# Altium schematic sheet CYAN_AMP_2.SchDoc
size A3
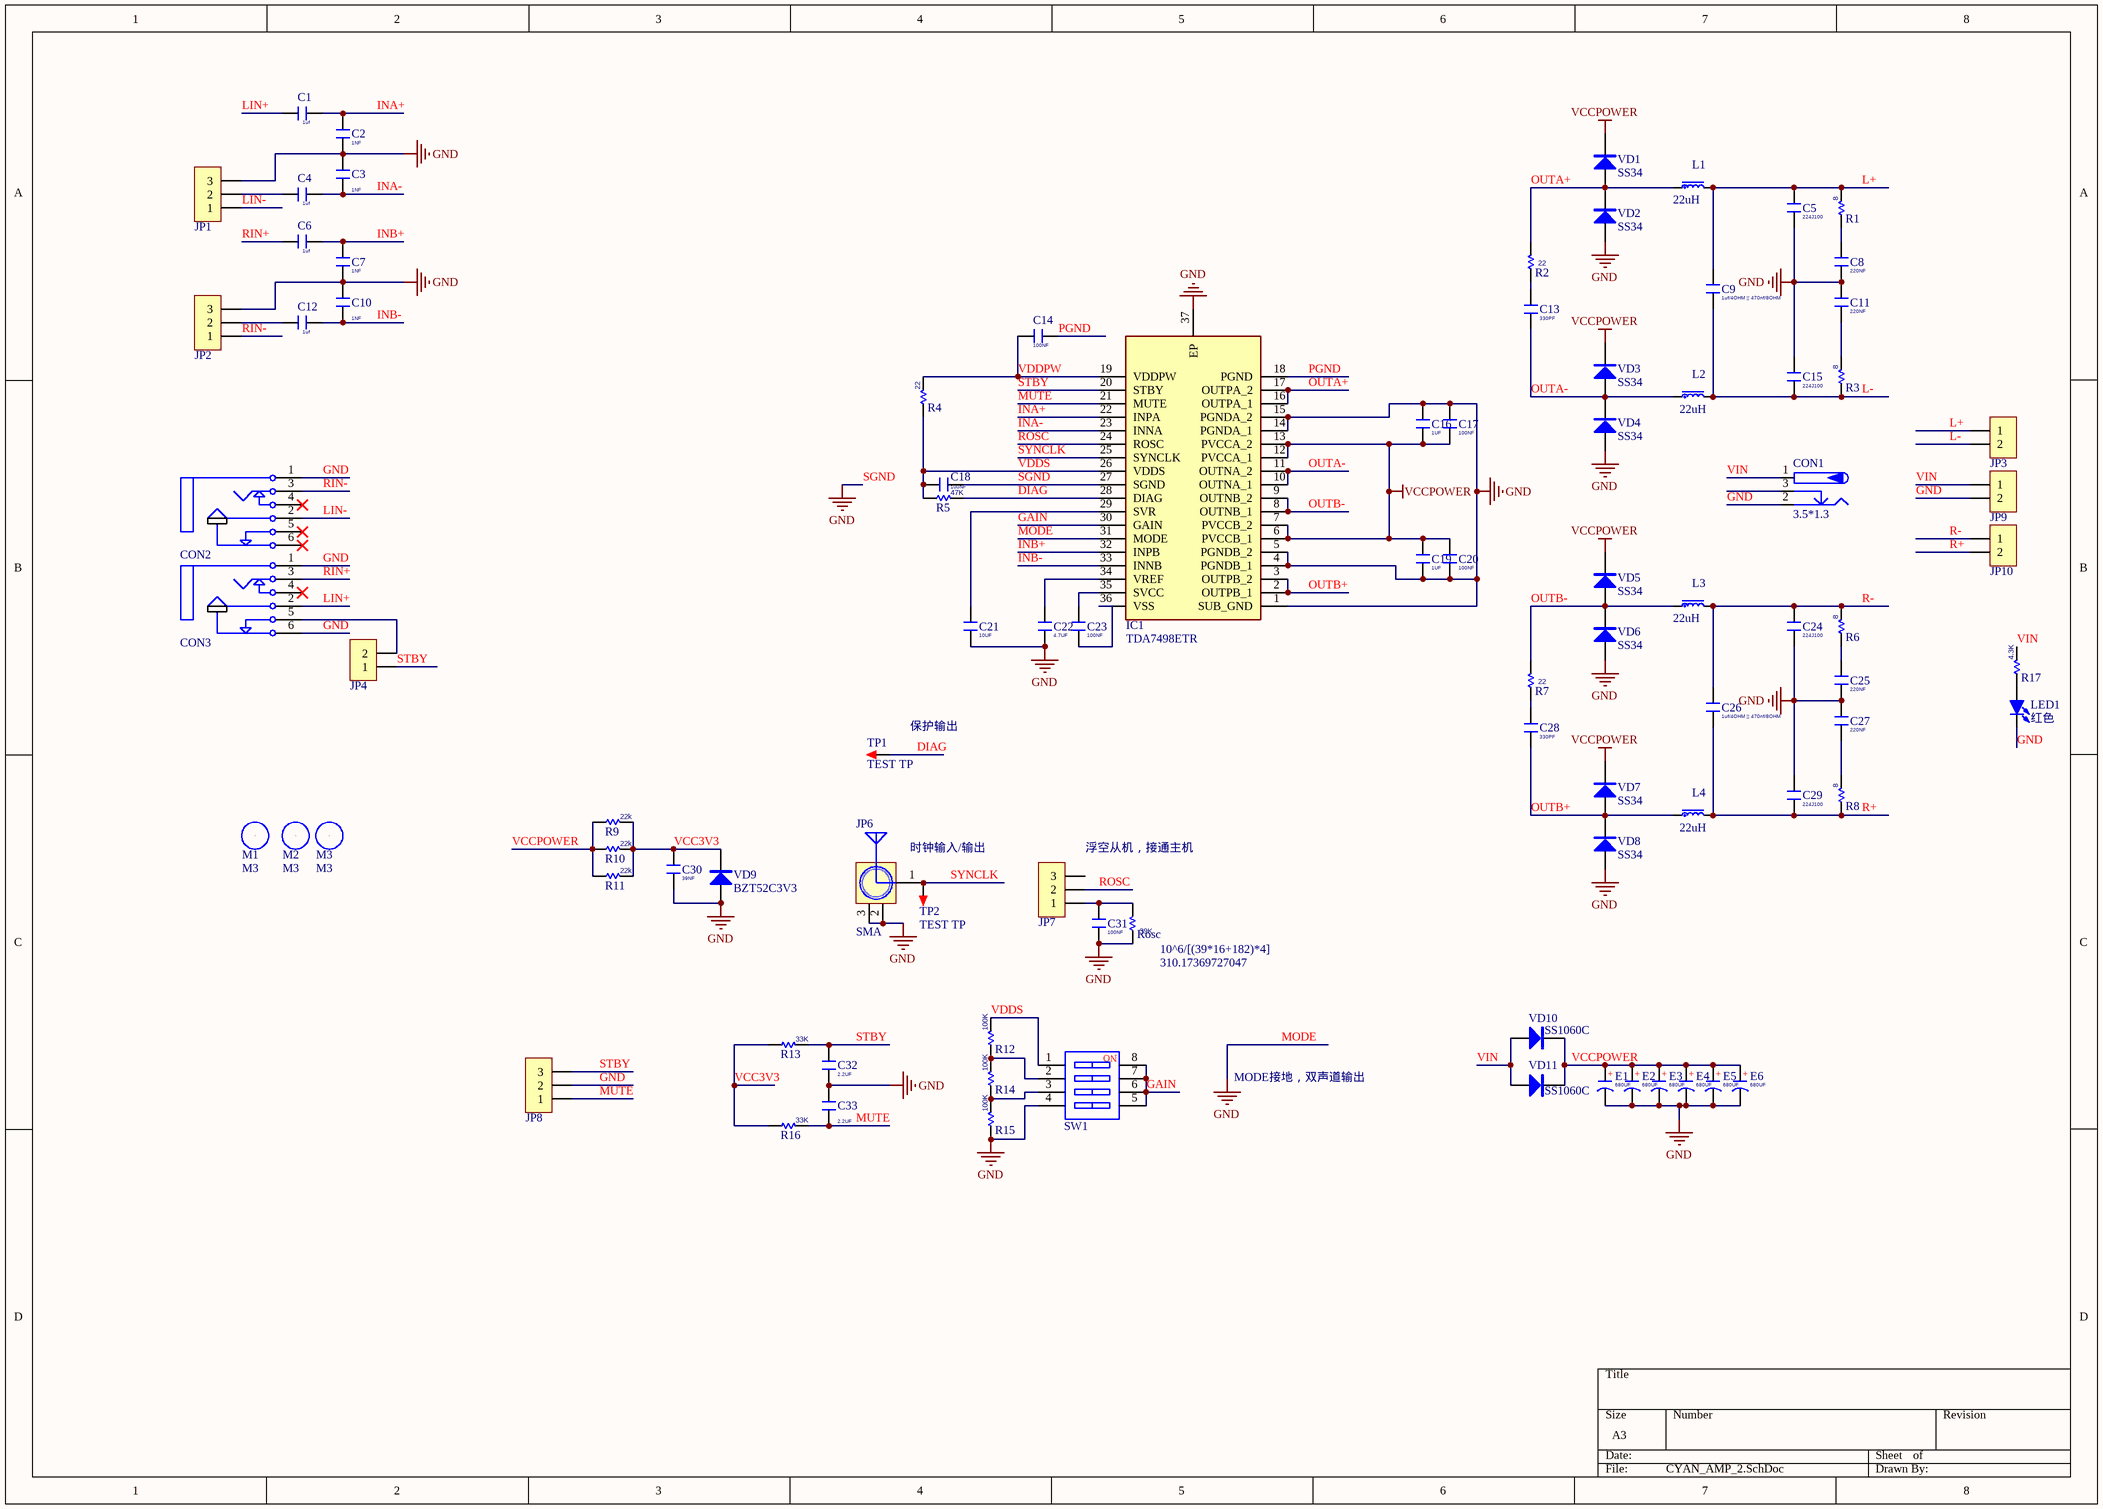
[diagram p0: CYAN_AMP_2.SchDoc]

## Parts
C1  value 1uf  [CBB-T 5*10*5.4]
C2  value 1NF  [C 0805]  (hidden comment: C)
C3  value 1NF  [C 0805]  (hidden comment: C)
C4  value 1uf  [CBB-T 5*10*5.4]
C5  value 224J100  [CBB-T 5*7.5*3.5]
C6  value 1uf  [CBB-T 5*10*5.4]
C7  value 1NF  [C 0805]  (hidden comment: C)
C8  value 220NF  [C 0805]  (hidden comment: C)
C9  value 1uf/4OHM || 470nf/8OHM  [CBB-T 5*10*5.4]
C10  value 1NF  [C 0805]  (hidden comment: C)
C11  value 220NF  [C 0805]  (hidden comment: C)
C12  value 1uf  [CBB-T 5*10*5.4]
C13  value 330PF  [C 0805]  (hidden comment: C)
C14  value 100NF  [C 0805]  (hidden comment: C)
C15  value 224J100  [CBB-T 5*7.5*3.5]
C16  value 1UF  [C 0805]  (hidden comment: C)
C17  value 100NF  [C 0805]  (hidden comment: C)
C18  value 100NF  [C 0805]  (hidden comment: C)
C19  value 1UF  [C 0805]  (hidden comment: C)
C20  value 100NF  [C 0805]  (hidden comment: C)
C21  value 10UF  [C 0805]  (hidden comment: C)
C22  value 4.7UF  [C 0805]  (hidden comment: C)
C23  value 100NF  [C 0805]  (hidden comment: C)
C24  value 224J100  [CBB-T 5*7.5*3.5]
C25  value 220NF  [C 0805]  (hidden comment: C)
C26  value 1uf/4OHM || 470nf/8OHM  [CBB-T 5*10*5.4]
C27  value 220NF  [C 0805]  (hidden comment: C)
C28  value 330PF  [C 0805]  (hidden comment: C)
C29  value 224J100  [CBB-T 5*7.5*3.5]
C30  value 39NF  [C 0805]  (hidden comment: C)
C31  value 100NF  [C 0805]  (hidden comment: C)
C32  value 2.2UF  [C 0805]  (hidden comment: C)
C33  value 2.2UF  [C 0805]  (hidden comment: C)
CON1  3.5*1.3  [DC-005]
CON2  PJ342  [PJ343]  (value not drawn)
CON3  PJ342  [PJ343]  (value not drawn)
E1  value 680UF  [CAP 5.0*12.5*20-H]
E2  value 680UF  [CAP 5.0*12.5*20-H]
E3  value 680UF  [CAP 5.0*12.5*20-H]
E4  value 680UF  [CAP 5.0*12.5*20-H]
E5  value 680UF  [CAP 5.0*12.5*20-H]
E6  value 680UF  [CAP 5.0*12.5*20-H]
IC1  TDA7498ETR  [TDA7498E-SSOP36]
JP1  HDR-1X3  [HDR-1X3]  (value not drawn)
JP2  HDR-1X3  [HDR-1X3]  (value not drawn)
JP3  HDR-1X2  [KF301-2P]  (value not drawn)
JP4  HDR-1X2  [HDR-1X2]  (value not drawn)
JP6  SMA  [SMA_FR]
JP7  HDR-1X3  [HDR-1X3]  (value not drawn)
JP8  HDR-1X3  [HDR-1X3]  (value not drawn)
JP9  HDR-1X2  [KF301-2P]  (value not drawn)
JP10  HDR-1X2  [KF301-2P]  (value not drawn)
L1  22uH  [7G17A/C]
L2  22uH  [7G17A/C]
L3  22uH  [7G17A/C]
L4  22uH  [7G17A/C]
LED1  红色  [LED 1206R]
M1  M3  [M3 125X200]
M2  M3  [M3 125X200]
M3  M3  [M3 125X200]
R1  value 8  [R 0805]  (hidden comment: R)
R2  value 22  [R 0805]  (hidden comment: R)
R3  value 8  [R 0805]  (hidden comment: R)
R4  value 22  [R 0805]  (hidden comment: R)
R5  value 47K  [R 0805]  (hidden comment: R)
R6  value 8  [R 0805]  (hidden comment: R)
R7  value 22  [R 0805]  (hidden comment: R)
R8  value 8  [R 0805]  (hidden comment: R)
R9  value 22k  [R 0805]  (hidden comment: R)
R10  value 22k  [R 0805]  (hidden comment: R)
R11  value 22k  [R 0805]  (hidden comment: R)
R12  value 100K  [R 0805]  (hidden comment: R)
R13  value 33K  [R 0805]  (hidden comment: R)
R14  value 100K  [R 0805]  (hidden comment: R)
R15  value 100K  [R 0805]  (hidden comment: R)
R16  value 33K  [R 0805]  (hidden comment: R)
R17  value 4.3K  [R 0805]  (hidden comment: R)
Rosc  value 39K  [R 0805]  (hidden comment: R)
SW1  CSW-4P  [CSW1.27 SMD-4P]  (value not drawn)
TP1  TEST TP  [TEST TP1.4_B]
TP2  TEST TP  [TEST TP1.4_B]
VD1  SS34  [SMA]
VD2  SS34  [SMA]
VD3  SS34  [SMA]
VD4  SS34  [SMA]
VD5  SS34  [SMA]
VD6  SS34  [SMA]
VD7  SS34  [SMA]
VD8  SS34  [SMA]
VD9  BZT52C3V3  [SOD-123]
VD10  SS1060C  [SMC]
VD11  SS1060C  [SMC]

## Nets
GND: C2.1 C3.2 C5.1 C7.1 C8.1 C10.2 C11.2 C15.2 C16.2 C17.2 C18.1 C19.2 C20.2 C21.1 C22.1 C24.1 C25.1 C27.2 C29.2 C30.1 C31.1 C32.1 C33.2 CON1.2 CON2.1 CON3.1 CON3.6 E1.2 E2.2 E3.2 E4.2 E5.2 E6.2 IC1.1(SUB_GND) IC1.4(PGNDB_1) IC1.5(PGNDB_2) IC1.14(PGNDA_1) IC1.15(PGNDA_2) IC1.27(SGND) IC1.31(MODE) IC1.37(EP) JP1.3 JP2.3 JP6.2(GND) JP6.3(GND) JP8.2 JP9.2 LED1.2(K) R15.1 Rosc.1 SW1.4 VD2.1(A) VD4.1(A) VD6.1(A) VD8.1(A) VD9.1(A)  [also labelled MODE, SGND]
VCCPOWER: C16.1 C17.1 C19.1 C20.1 E1.1 E2.1 E3.1 E4.1 E5.1 E6.1 IC1.6(PVCCB_1) IC1.7(PVCCB_2) IC1.12(PVCCA_1) IC1.13(PVCCA_2) R9.1 R10.1 R11.1 VD1.2(K) VD3.2(K) VD5.2(K) VD7.2(K) VD10.2(K) VD11.2(K)
DIAG: IC1.28(DIAG) R5.2 TP1.1
GAIN: IC1.30(GAIN) SW1.5 SW1.6 SW1.7 SW1.8
INA+: C1.2 C2.2 IC1.22(INPA)
INA-: C3.1 C4.2 IC1.23(INNA)
INB+: C6.2 C7.2 IC1.32(INPB)
INB-: C10.1 C12.2 IC1.33(INNB)
L+: C5.2 C9.2 JP3.1 L1.2 R1.2
L-: C9.1 C15.1 JP3.2 L2.2 R3.1
LIN+: C1.1 CON3.2
LIN-: CON2.2 JP1.1
MUTE: C33.1 IC1.21(MUTE) JP8.1 R16.2
OUTA+: IC1.16(OUTPA_1) IC1.17(OUTPA_2) L1.1 R2.2 VD1.1(A) VD2.2(K)
OUTA-: C13.1 IC1.10(OUTNA_1) IC1.11(OUTNA_2) L2.1 VD3.1(A) VD4.2(K)
OUTB+: C28.1 IC1.2(OUTPB_1) IC1.3(OUTPB_2) L4.1 VD7.1(A) VD8.2(K)
OUTB-: IC1.8(OUTNB_1) IC1.9(OUTNB_2) L3.1 R7.2 VD5.1(A) VD6.2(K)
PGND: C14.1 IC1.18(PGND)
R+: C26.1 C29.1 JP10.2 L4.2 R8.1
R-: C24.2 C26.2 JP10.1 L3.2 R6.2
RIN+: C6.1 CON3.3
RIN-: CON2.3 JP2.1
ROSC: IC1.24(ROSC) JP7.2
STBY: C32.2 IC1.20(STBY) JP4.1 JP8.3 R13.2
SYNCLK: IC1.25(SYNCLK) JP6.1(ANT) TP2.1
VCC3V3: C30.2 R9.2 R10.2 R11.2 R13.1 R16.1 VD9.2(K)
VDDPW: C14.2 IC1.19(VDDPW) R4.2
VDDS: C18.2 IC1.26(VDDS) R4.1 R5.1 R12.2 SW1.1
VIN: CON1.1 JP9.1 R17.2 VD10.1(A) VD11.1(A)
NetC4_1: C4.1 JP1.2
NetC8_2: C8.2 R1.1
NetC11_1: C11.1 R3.2
NetC12_1: C12.1 JP2.2
NetC13_2: C13.2 R2.1
NetC21_2: C21.2 IC1.29(SVR)
NetC22_2: C22.2 IC1.34(VREF)
NetC23_1: C23.1 IC1.36(VSS)
NetC23_2: C23.2 IC1.35(SVCC)
NetC25_2: C25.2 R6.1
NetC27_1: C27.1 R8.2
NetC28_2: C28.2 R7.1
NetC31_2: C31.2 JP7.1 Rosc.2
NetCON3_5: CON3.5 JP4.2
NetLED1_1: LED1.1(A) R17.1
NetR12_1: R12.1 R14.2 SW1.2
NetR14_1: R14.1 R15.2 SW1.3

Not connected (* = marked no-connect by the designer): CON1 3; CON2 4* 5* 6*; CON3 4*; JP7 3; M1 0; M2 0; M3 0

## Notes on the sheet
- (near TP1) 保护输出
- 时钟输入/输出
- (near JP7) 浮空从机，接通主机
- (near Rosc) 10^6/[(39*16+182)*4]
- (near Rosc) 310.17369727047
- MODE接地，双声道输出
- (in symbol C-CAP) +
- (in symbol CSW-4P) NO

## Library data of the parts
C1 C4-C6 C9 C12 C15 C24 C26 C29 = C-CBB: CBB电容; Voltage: 10v
C2 C3 C7 C8 C10 C11 C13 C14 C16-C23 C25 C27 C28 C30-C33 = C: 无极性贴片电容; Voltage: 20V
CON1 = P-DC: 低压电源接口
CON2 CON3 = PJ343: 3.5耳机插座,6Pin
E1-E6 = C-CAP: 直插电解电容; Voltage: 50V
IC1 = TDA7498ETR: Integrated Circuit; Manufacturer_Name: STMicroelectronics; Datasheet Link: http://www.mouser.com/ds/2/389/DM00044235-249497.pdf; Height: 2.47mm; Manufacturer_Part_Number: TDA7498ETR; Mouser Part Number: 511-TDA7498ETR; Mouser Price/Stock: https://www.mouser.com/Search/Refine.aspx?Keyword=511-TDA7498ETR
JP1 JP2 JP7 JP8 = Header 3: 3P接插件
JP3 JP4 JP9 JP10 = Header 2: 2P接插件
JP6 = SMA: SMA-2.4G射频天线接口
L1-L4 = L-PK: 工字电感
LED1 = LED-SMD: 贴片LED
M1-M3 = M3: 铜柱孔
R1-R17 Rosc = R: 贴片电阻
SW1 = CSW-4P: 4路编码开关
TP1 TP2 = TEST TP: 测试环
VD1-VD8 = SS14: 肖特基二极管
VD9 = 1N4007: 整流二极管
VD10 VD11 = SS34: 肖特基二极管